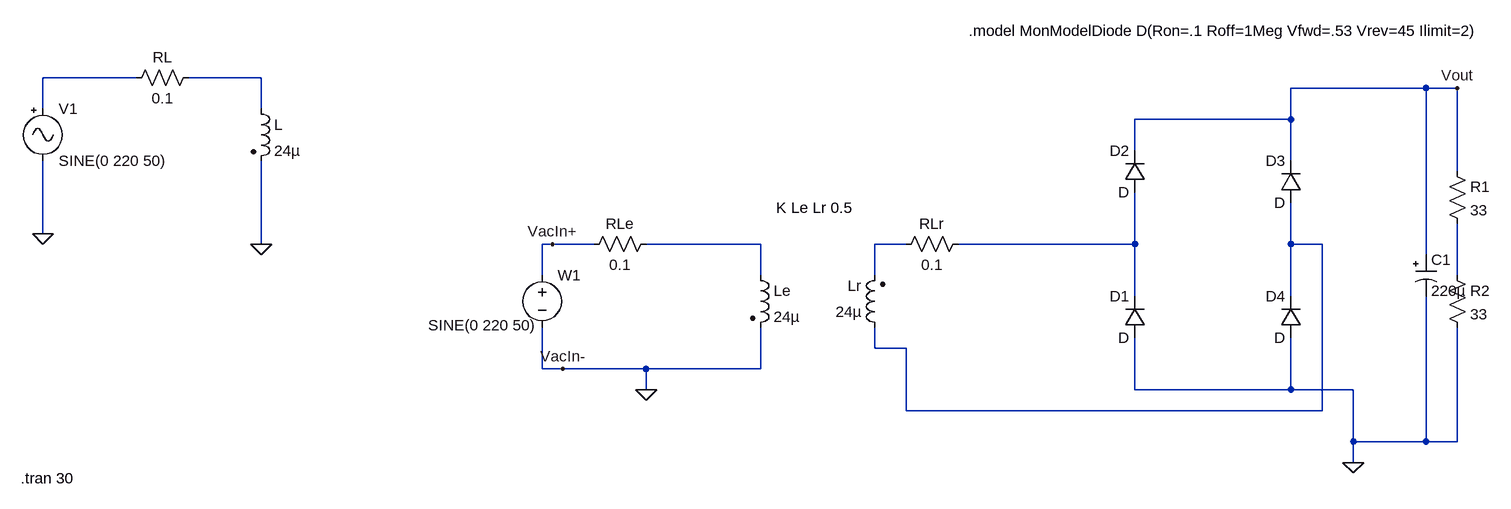
[diagram p0: schematic Pont_Diode.asc]
Pont_Diode.asc, the LTspice schematic file:
Version 4
SHEET 1 1356 680
WIRE -1200 -128 -1344 -128
WIRE -1008 -128 -1120 -128
WIRE 784 -112 576 -112
WIRE 832 -112 784 -112
WIRE -1344 -80 -1344 -128
WIRE -1008 -80 -1008 -128
WIRE 576 -64 576 -112
WIRE 576 -64 336 -64
WIRE 336 -16 336 -64
WIRE 576 0 576 -64
WIRE 832 16 832 -112
WIRE -1344 112 -1344 0
WIRE -1008 128 -1008 0
WIRE -560 128 -576 128
WIRE -496 128 -560 128
WIRE -240 128 -416 128
WIRE -16 128 -64 128
WIRE 336 128 336 48
WIRE 336 128 64 128
WIRE 576 128 576 64
WIRE 624 128 576 128
WIRE 784 144 784 -112
WIRE -576 176 -576 128
WIRE -240 176 -240 128
WIRE -64 176 -64 128
WIRE 832 176 832 96
WIRE 336 208 336 128
WIRE 576 208 576 128
WIRE -64 288 -64 256
WIRE -16 288 -64 288
WIRE -576 320 -576 256
WIRE -544 320 -576 320
WIRE -416 320 -544 320
WIRE -240 320 -240 256
WIRE -240 320 -416 320
WIRE -416 352 -416 320
WIRE 336 352 336 272
WIRE 576 352 576 272
WIRE 576 352 336 352
WIRE 672 352 576 352
WIRE -16 384 -16 288
WIRE 624 384 624 128
WIRE 624 384 -16 384
WIRE 672 432 672 352
WIRE 784 432 784 208
WIRE 784 432 672 432
WIRE 832 432 832 256
WIRE 832 432 784 432
WIRE 672 464 672 432
FLAG 672 464 0
FLAG 832 -112 Vout
FLAG -560 128 VacIn+
FLAG -544 320 VacIn-
FLAG -416 352 0
FLAG -1344 112 0
FLAG -1008 128 0
SYMBOL voltage -576 160 R0
WINDOW 3 -175 93 Left 2
WINDOW 123 0 0 Left 0
WINDOW 39 0 0 Left 0
SYMATTR Value SINE(0 220 50)
SYMATTR InstName W1
SYMBOL res 816 0 R0
SYMATTR InstName R1
SYMATTR Value 33
SYMBOL res 816 160 R0
SYMATTR InstName R2
SYMATTR Value 33
SYMBOL res -400 112 R90
WINDOW 0 0 56 VBottom 2
WINDOW 3 32 56 VTop 2
SYMATTR InstName RLe
SYMATTR Value 0.1
SYMBOL ind2 -256 160 R0
SYMATTR InstName Le
SYMATTR Value 24µ
SYMATTR Type ind
SYMBOL ind2 -48 272 R180
WINDOW 0 36 80 Left 2
WINDOW 3 36 40 Left 2
SYMATTR InstName Lr
SYMATTR Value 24µ
SYMATTR Type ind
SYMBOL res 80 112 R90
WINDOW 0 0 56 VBottom 2
WINDOW 3 32 56 VTop 2
SYMATTR InstName RLr
SYMATTR Value 0.1
SYMBOL Misc\\signal -1344 -96 R0
WINDOW 123 0 0 Left 0
WINDOW 39 0 0 Left 0
SYMATTR InstName V1
SYMATTR Value SINE(0 220 50)
SYMBOL res -1104 -144 R90
WINDOW 0 0 56 VBottom 2
WINDOW 3 32 56 VTop 2
SYMATTR InstName RL
SYMATTR Value 0.1
SYMBOL ind2 -1024 -96 R0
SYMATTR InstName L
SYMATTR Value 24µ
SYMATTR Type ind
SYMBOL diode 352 48 R180
WINDOW 0 24 64 Left 2
WINDOW 3 24 0 Left 2
SYMATTR InstName D2
SYMBOL diode 592 64 R180
WINDOW 0 24 64 Left 2
WINDOW 3 24 0 Left 2
SYMATTR InstName D3
SYMBOL diode 352 272 R180
WINDOW 0 24 64 Left 2
WINDOW 3 24 0 Left 2
SYMATTR InstName D1
SYMBOL diode 592 272 R180
WINDOW 0 24 64 Left 2
WINDOW 3 24 0 Left 2
SYMATTR InstName D4
SYMBOL polcap 768 144 R0
SYMATTR InstName C1
SYMATTR Value 220µ
TEXT 80 -200 Left 2 !.model MonModelDiode D(Ron=.1 Roff=1Meg Vfwd=.53 Vrev=45 Ilimit=2)
TEXT -216 72 Left 2 !K Le Lr 0.5
TEXT -1378 488 Left 2 !.tran 30

The netlist it stands for:
* Pont_Diode.asc
V§W1 VacIn+ 0 SINE(0 220 50)
R1 Vout N007 33
R2 N007 0 33
RLe N003 VacIn+ 0.1
Le N003 0 24µ
Lr N006 N004 24µ
RLr N005 N004 0.1
V1 N001 0 SINE(0 220 50)
RL N002 N001 0.1
L N002 0 24µ
D2 N005 Vout D
D3 N006 Vout D
D1 0 N005 D
D4 0 N006 D
C1 Vout 0 220µ
.model D D
.lib standard.dio
.model MonModelDiode D(Ron=.1 Roff=1Meg Vfwd=.53 Vrev=45 Ilimit=2)
K Le Lr 0.5
.tran 30
.backanno
.end